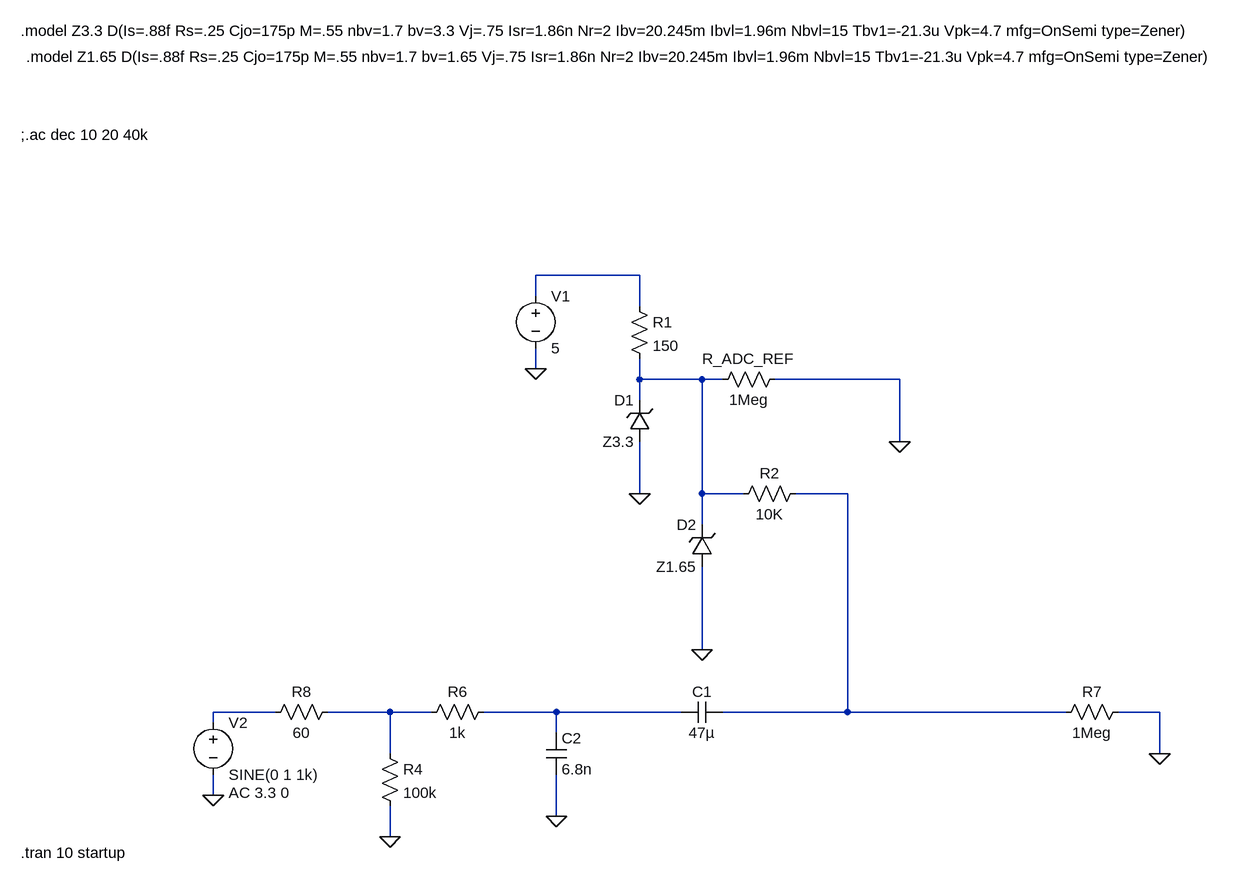
[diagram p0: schematic adc_capture_z1.65.asc]
adc_capture_z1.65.asc, the LTspice schematic file:
Version 4
SHEET 1 1336 932
WIRE 208 -32 48 -32
WIRE 48 0 48 -32
WIRE 208 16 208 -32
WIRE 48 112 48 80
WIRE 208 128 208 96
WIRE 304 128 208 128
WIRE 336 128 304 128
WIRE 608 128 416 128
WIRE 208 160 208 128
WIRE 608 224 608 128
WIRE 208 304 208 224
WIRE 304 304 304 128
WIRE 368 304 304 304
WIRE 528 304 448 304
WIRE 304 352 304 304
WIRE 304 544 304 416
WIRE -352 640 -448 640
WIRE -176 640 -272 640
WIRE -112 640 -176 640
WIRE 80 640 -32 640
WIRE 272 640 80 640
WIRE 528 640 528 304
WIRE 528 640 336 640
WIRE 864 640 528 640
WIRE 1008 640 944 640
WIRE -448 656 -448 640
WIRE 80 672 80 640
WIRE -176 704 -176 640
WIRE 1008 704 1008 640
WIRE -448 768 -448 736
WIRE 80 800 80 736
WIRE -176 832 -176 784
FLAG 208 304 0
FLAG 608 224 0
FLAG 48 112 0
FLAG 304 544 0
FLAG -448 768 0
FLAG 80 800 0
FLAG 1008 704 0
FLAG -176 832 0
SYMBOL zener 224 224 R180
WINDOW 0 24 64 Left 2
WINDOW 3 24 0 Left 2
SYMATTR InstName D1
SYMATTR Value Z3.3
SYMBOL res 192 0 R0
SYMATTR InstName R1
SYMATTR Value 150
SYMBOL res 432 112 R90
WINDOW 0 0 56 VBottom 2
WINDOW 3 32 56 VTop 2
SYMATTR InstName R_ADC_REF
SYMATTR Value 1Meg
SYMBOL voltage 48 -16 R0
WINDOW 123 0 0 Left 0
WINDOW 39 0 0 Left 0
SYMATTR InstName V1
SYMATTR Value 5
SYMBOL cap 336 624 R90
WINDOW 0 0 32 VBottom 2
WINDOW 3 32 32 VTop 2
SYMATTR InstName C1
SYMATTR Value 47µ
SYMBOL voltage -448 640 R0
WINDOW 123 24 124 Left 2
WINDOW 39 0 0 Left 0
SYMATTR Value2 AC 3.3 0
SYMATTR InstName V2
SYMATTR Value SINE(0 1 1k)
SYMBOL res -16 624 R90
WINDOW 0 0 56 VBottom 2
WINDOW 3 32 56 VTop 2
SYMATTR InstName R6
SYMATTR Value 1k
SYMBOL cap 64 672 R0
SYMATTR InstName C2
SYMATTR Value 6.8n
SYMBOL res 960 624 R90
WINDOW 0 0 56 VBottom 2
WINDOW 3 32 56 VTop 2
SYMATTR InstName R7
SYMATTR Value 1Meg
SYMBOL res -256 624 R90
WINDOW 0 0 56 VBottom 2
WINDOW 3 32 56 VTop 2
SYMATTR InstName R8
SYMATTR Value 60
SYMBOL res -192 688 R0
SYMATTR InstName R4
SYMATTR Value 100k
SYMBOL zener 320 416 R180
WINDOW 0 24 64 Left 2
WINDOW 3 24 0 Left 2
SYMATTR InstName D2
SYMATTR Value Z1.65
SYMATTR Description Diode
SYMATTR Type diode
SYMBOL res 464 288 R90
WINDOW 0 0 56 VBottom 2
WINDOW 3 32 56 VTop 2
SYMATTR InstName R2
SYMATTR Value 10K
TEXT -744 -408 Left 2 !.model Z3.3 D(Is=.88f Rs=.25 Cjo=175p M=.55 nbv=1.7 bv=3.3 Vj=.75 Isr=1.86n Nr=2 Ibv=20.245m Ibvl=1.96m Nbvl=15 Tbv1=-21.3u Vpk=4.7 mfg=OnSemi type=Zener)
TEXT -744 -248 Left 2 !;.ac dec 10 20 40k
TEXT -736 -368 Left 2 !.model Z1.65 D(Is=.88f Rs=.25 Cjo=175p M=.55 nbv=1.7 bv=1.65 Vj=.75 Isr=1.86n Nr=2 Ibv=20.245m Ibvl=1.96m Nbvl=15 Tbv1=-21.3u Vpk=4.7 mfg=OnSemi type=Zener)
TEXT -744 856 Left 2 !.tran 10 startup

The netlist it stands for:
* adc_capture_z1.65.asc
D1 0 N002 Z3.3
R1 N001 N002 150
R_ADC_REF 0 N002 1Meg
V1 N001 0 5
C1 N003 N006 47µ
V2 N004 0 SINE(0 1 1k) AC 3.3 0
R6 N006 N005 1k
C2 N006 0 6.8n
R7 0 N003 1Meg
R8 N005 N004 60
R4 N005 0 100k
D2 0 N002 Z1.65
R2 N003 N002 10K
.model D D
.lib standard.dio
.model Z3.3 D(Is=.88f Rs=.25 Cjo=175p M=.55 nbv=1.7 bv=3.3 Vj=.75 Isr=1.86n Nr=2 Ibv=20.245m Ibvl=1.96m Nbvl=15 Tbv1=-21.3u Vpk=4.7 mfg=OnSemi type=Zener)
;.ac dec 10 20 40k
.model Z1.65 D(Is=.88f Rs=.25 Cjo=175p M=.55 nbv=1.7 bv=1.65 Vj=.75 Isr=1.86n Nr=2 Ibv=20.245m Ibvl=1.96m Nbvl=15 Tbv1=-21.3u Vpk=4.7 mfg=OnSemi type=Zener)
.tran 10 startup
.backanno
.end